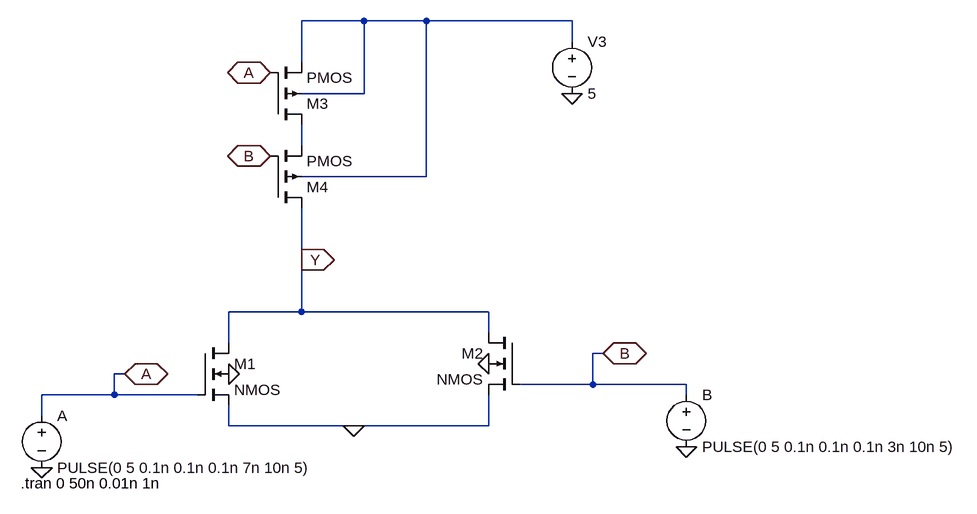
[diagram p0: schematic nor.asc]
nor.asc, the LTspice schematic file:
Version 4
SHEET 1 988 680
WIRE 16 -928 -80 -928
WIRE 112 -928 16 -928
WIRE 336 -928 112 -928
WIRE 336 -896 336 -928
WIRE -80 -864 -80 -928
WIRE 16 -816 16 -928
WIRE 16 -816 -80 -816
WIRE -80 -736 -80 -768
WIRE 112 -688 112 -928
WIRE 112 -688 -80 -688
WIRE -80 -560 -80 -640
WIRE -80 -480 -80 -560
WIRE -80 -480 -192 -480
WIRE 208 -480 -80 -480
WIRE 208 -448 208 -480
WIRE -192 -432 -192 -480
WIRE 384 -416 368 -416
WIRE -352 -384 -368 -384
WIRE 368 -368 368 -416
WIRE 368 -368 256 -368
WIRE 512 -368 368 -368
WIRE -368 -352 -368 -384
WIRE -368 -352 -480 -352
WIRE -240 -352 -368 -352
WIRE 512 -352 512 -368
WIRE -480 -320 -480 -352
WIRE -192 -304 -192 -336
WIRE 0 -304 -192 -304
WIRE 208 -304 208 -352
WIRE 208 -304 0 -304
FLAG -480 -240 0
FLAG 512 -272 0
FLAG 336 -816 0
FLAG -352 -384 A
IOPIN -352 -384 BiDir
FLAG 384 -416 B
IOPIN 384 -416 BiDir
FLAG -128 -848 A
IOPIN -128 -848 BiDir
FLAG -128 -720 B
IOPIN -128 -720 BiDir
FLAG -80 -560 Y
IOPIN -80 -560 Out
FLAG 0 -304 0
FLAG -192 -384 0
FLAG 208 -400 0
SYMBOL voltage -480 -336 R0
WINDOW 123 0 0 Left 2
WINDOW 39 0 0 Left 2
SYMATTR InstName A
SYMATTR Value PULSE(0 5 0.1n 0.1n 0.1n 7n 10n 5)
SYMBOL voltage 512 -368 R0
WINDOW 123 0 0 Left 2
WINDOW 39 0 0 Left 2
SYMATTR InstName B
SYMATTR Value PULSE(0 5 0.1n 0.1n 0.1n 3n 10n 5)
SYMBOL voltage 336 -912 R0
WINDOW 123 0 0 Left 2
WINDOW 39 0 0 Left 2
SYMATTR InstName V3
SYMATTR Value 5
SYMBOL nmos4 -240 -432 R0
SYMATTR InstName M1
SYMBOL nmos4 256 -448 M0
SYMATTR InstName M2
SYMBOL pmos4 -128 -768 M180
SYMATTR InstName M3
SYMBOL pmos4 -128 -640 M180
SYMATTR InstName M4
TEXT -512 -216 Left 2 !.tran 0 50n 0.01n 1n

The netlist it stands for:
* nor.asc
V§A A 0 PULSE(0 5 0.1n 0.1n 0.1n 7n 10n 5)
V§B B 0 PULSE(0 5 0.1n 0.1n 0.1n 3n 10n 5)
V3 N001 0 5
M1 Y A 0 0 NMOS
M2 Y B 0 0 NMOS
M3 N002 A N001 N001 PMOS
M4 Y B N002 N001 PMOS
.model NMOS NMOS
.model PMOS PMOS
.lib standard.mos
.tran 0 50n 0.01n 1n
.backanno
.end